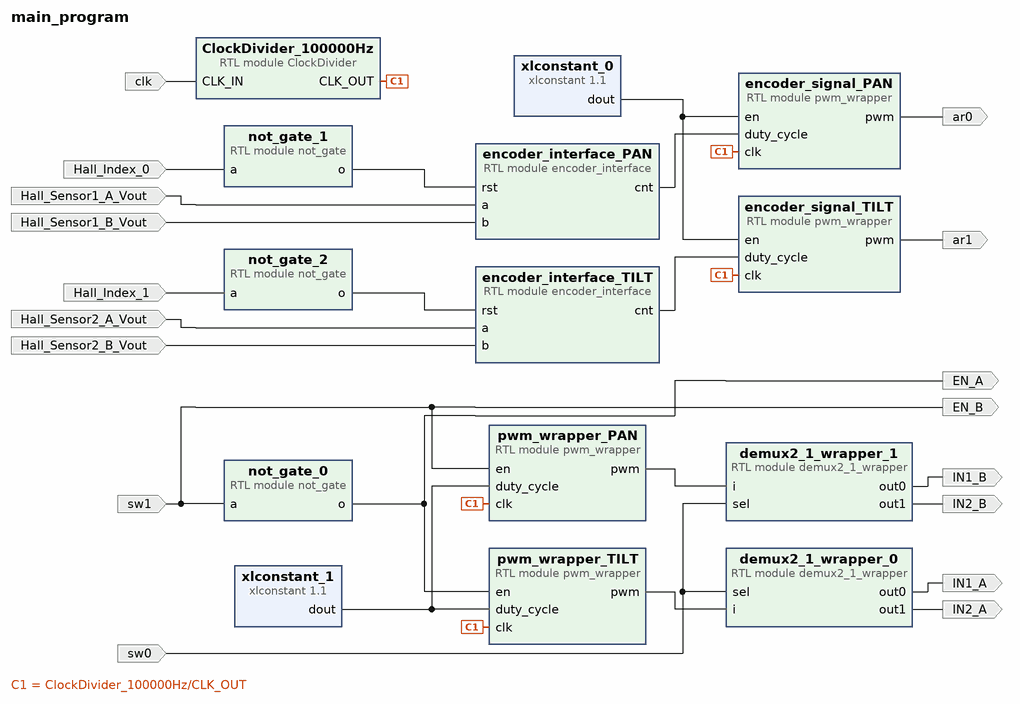
[diagram p0: block diagram of the top level]
# Vivado block design main_program, xc7z020clg400-1, Vivado 2023.2
create_bd_design main_program

create_bd_port -dir I clk
create_bd_port -dir I sw1
create_bd_port -dir I sw0
create_bd_port -dir O IN1_A
create_bd_port -dir O IN2_A
create_bd_port -dir O IN1_B
create_bd_port -dir O IN2_B
create_bd_port -dir O EN_B
create_bd_port -dir O EN_A
create_bd_port -dir I Hall_Sensor1_A_Vout
create_bd_port -dir I Hall_Sensor2_A_Vout
create_bd_port -dir I Hall_Sensor1_B_Vout
create_bd_port -dir I Hall_Sensor2_B_Vout
create_bd_port -dir I Hall_Index_0
create_bd_port -dir I Hall_Index_1
create_bd_port -dir O ar0
create_bd_port -dir O ar1

create_bd_cell -type ip -vlnv xilinx.com:ip:xlconstant:1.1 xlconstant_1
set_property -dict {CONFIG.CONST_VAL 500 CONFIG.CONST_WIDTH 27} [get_bd_cells xlconstant_1]
create_bd_cell -type module -reference pwm_wrapper pwm_wrapper_TILT
create_bd_cell -type module -reference ClockDivider ClockDivider_100000Hz
set_property -dict {CONFIG.DIVISOR 0x00004E2} [get_bd_cells ClockDivider_100000Hz]
create_bd_cell -type module -reference pwm_wrapper pwm_wrapper_PAN
create_bd_cell -type module -reference demux2_1_wrapper demux2_1_wrapper_0
create_bd_cell -type module -reference demux2_1_wrapper demux2_1_wrapper_1
create_bd_cell -type module -reference not_gate not_gate_0
create_bd_cell -type module -reference encoder_interface encoder_interface_PAN
create_bd_cell -type module -reference encoder_interface encoder_interface_TILT
create_bd_cell -type module -reference not_gate not_gate_1
create_bd_cell -type module -reference not_gate not_gate_2
create_bd_cell -type module -reference pwm_wrapper encoder_signal_PAN
create_bd_cell -type module -reference pwm_wrapper encoder_signal_TILT
create_bd_cell -type ip -vlnv xilinx.com:ip:xlconstant:1.1 xlconstant_0

# ---- connections ----

connect_bd_net -net ClockDivider_0_CLK_OUT [get_bd_pins ClockDivider_100000Hz/CLK_OUT] \
  [get_bd_pins pwm_wrapper_TILT/clk] [get_bd_pins pwm_wrapper_PAN/clk] [get_bd_pins encoder_signal_PAN/clk] \
  [get_bd_pins encoder_signal_TILT/clk]
connect_bd_net -net Hall_Index_0_1 [get_bd_ports Hall_Index_0] [get_bd_pins not_gate_1/a]
connect_bd_net -net Hall_Index_1_1 [get_bd_ports Hall_Index_1] [get_bd_pins not_gate_2/a]
connect_bd_net [get_bd_ports Hall_Sensor1_A_Vout] [get_bd_pins encoder_interface_PAN/a]
connect_bd_net [get_bd_ports Hall_Sensor1_B_Vout] [get_bd_pins encoder_interface_PAN/b]
connect_bd_net [get_bd_ports Hall_Sensor2_A_Vout] [get_bd_pins encoder_interface_TILT/a]
connect_bd_net [get_bd_ports Hall_Sensor2_B_Vout] [get_bd_pins encoder_interface_TILT/b]
connect_bd_net [get_bd_ports clk] [get_bd_pins ClockDivider_100000Hz/CLK_IN]
connect_bd_net [get_bd_pins demux2_1_wrapper_0/out0] [get_bd_ports IN1_A]
connect_bd_net [get_bd_pins demux2_1_wrapper_0/out1] [get_bd_ports IN2_A]
connect_bd_net [get_bd_pins demux2_1_wrapper_1/out0] [get_bd_ports IN1_B]
connect_bd_net [get_bd_pins demux2_1_wrapper_1/out1] [get_bd_ports IN2_B]
connect_bd_net -net encoder_interface_MotorA_cnt [get_bd_pins encoder_interface_PAN/cnt] [get_bd_pins encoder_signal_PAN/duty_cycle]
connect_bd_net -net encoder_interface_MotorB_cnt [get_bd_pins encoder_interface_TILT/cnt] [get_bd_pins encoder_signal_TILT/duty_cycle]
connect_bd_net [get_bd_pins encoder_signal_PAN/pwm] [get_bd_ports ar0]
connect_bd_net [get_bd_pins encoder_signal_TILT/pwm] [get_bd_ports ar1]
connect_bd_net [get_bd_pins not_gate_0/o] [get_bd_ports EN_A] [get_bd_pins pwm_wrapper_TILT/en]
connect_bd_net [get_bd_pins not_gate_1/o] [get_bd_pins encoder_interface_PAN/rst]
connect_bd_net [get_bd_pins not_gate_2/o] [get_bd_pins encoder_interface_TILT/rst]
connect_bd_net -net pwm_wrapper_0_pwm [get_bd_pins pwm_wrapper_TILT/pwm] [get_bd_pins demux2_1_wrapper_0/i]
connect_bd_net -net pwm_wrapper_1_pwm [get_bd_pins pwm_wrapper_PAN/pwm] [get_bd_pins demux2_1_wrapper_1/i]
connect_bd_net -net sw0_1 [get_bd_ports sw0] [get_bd_pins demux2_1_wrapper_1/sel] [get_bd_pins demux2_1_wrapper_0/sel]
connect_bd_net -net sw1_1 [get_bd_ports sw1] [get_bd_pins not_gate_0/a] [get_bd_ports EN_B] [get_bd_pins pwm_wrapper_PAN/en]
connect_bd_net [get_bd_pins xlconstant_0/dout] [get_bd_pins encoder_signal_PAN/en] [get_bd_pins encoder_signal_TILT/en]
connect_bd_net [get_bd_pins xlconstant_1/dout] [get_bd_pins pwm_wrapper_TILT/duty_cycle] [get_bd_pins pwm_wrapper_PAN/duty_cycle]

validate_bd_design
save_bd_design
